# EAGLE design Rauchmelder 3.8.0 (EAGLE 9.6.2)
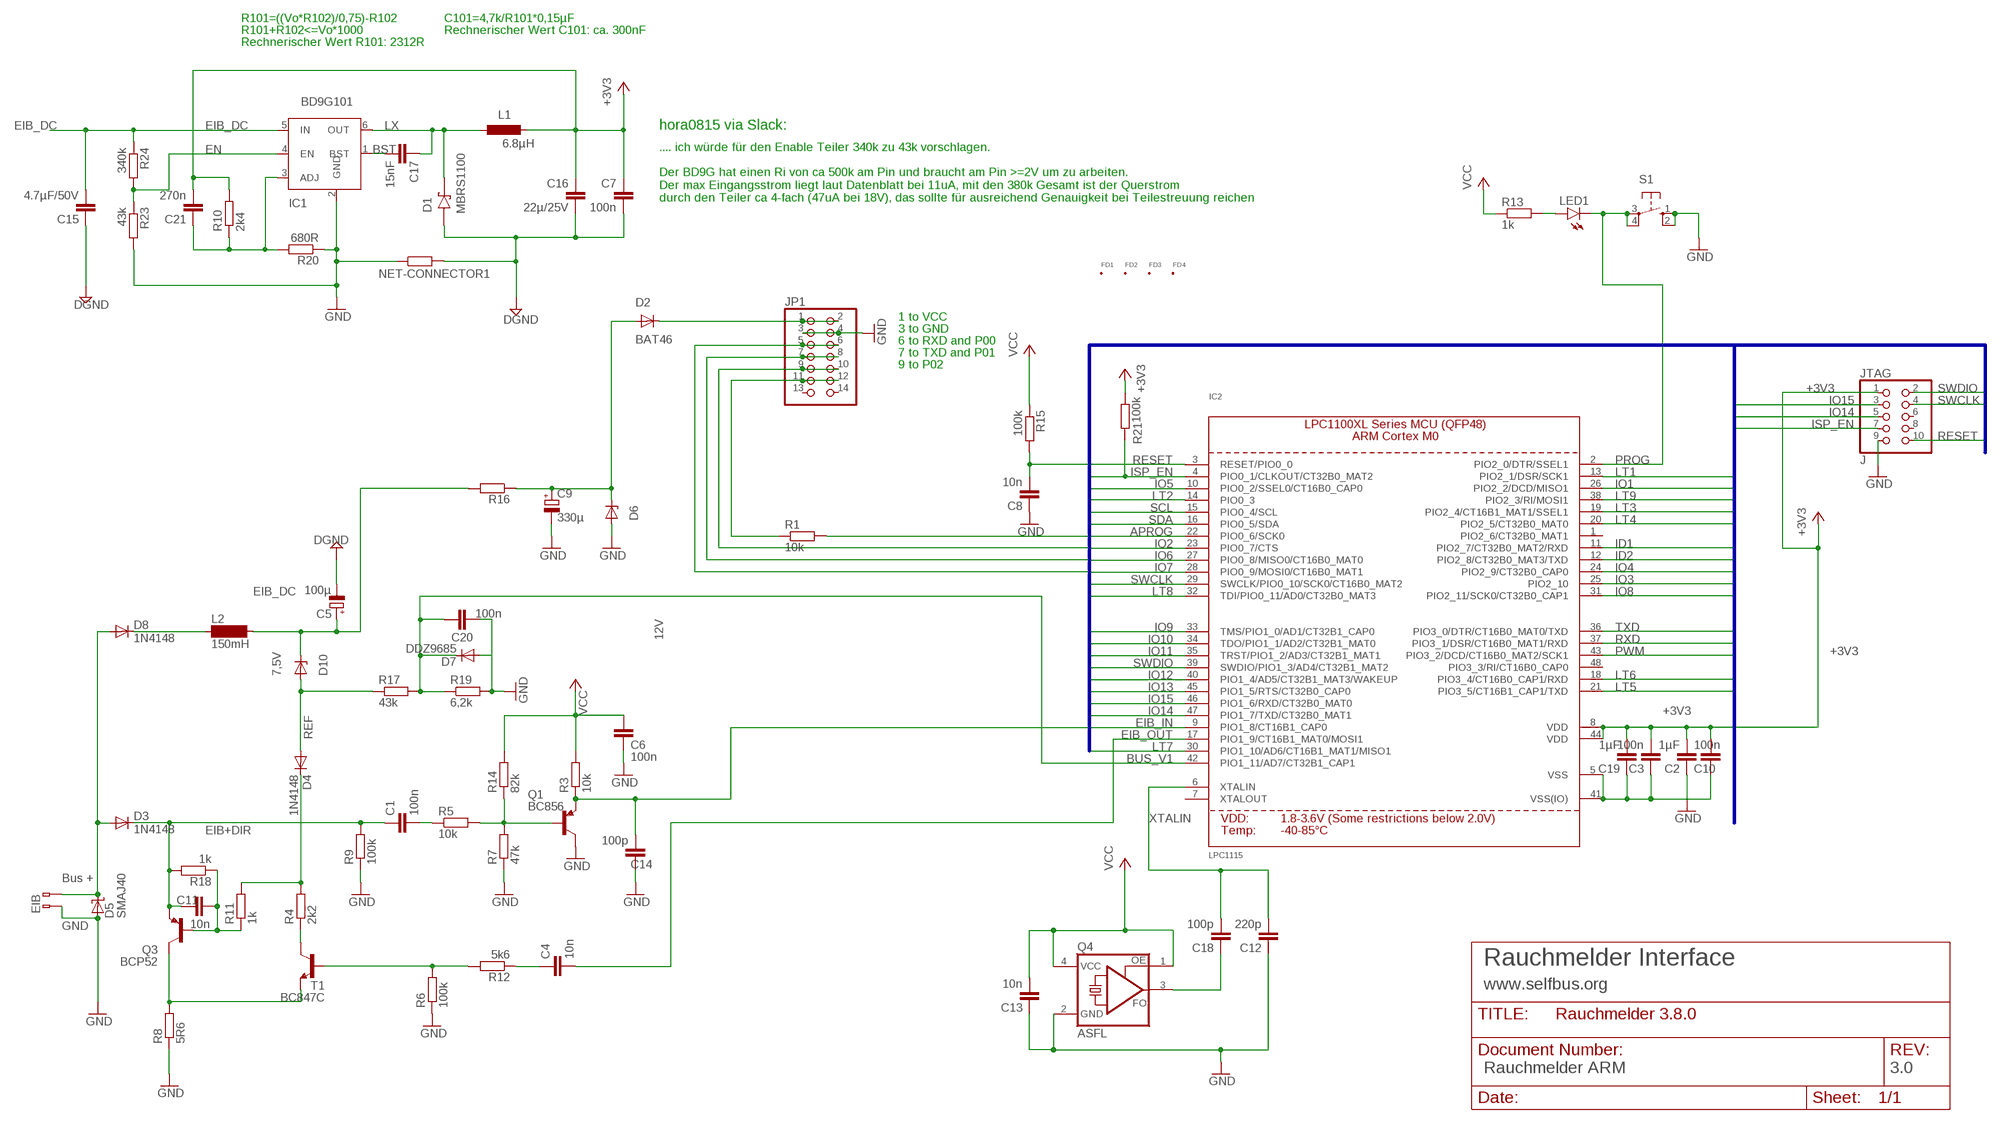
[diagram p0: schematic, sheet 1]

## Parts
C1  100n  C-EUC1206  [C1206]
C2  1µF  C-EUC1206  [C1206]
C3  100n  C-EUC1206  [C1206]
C4  10n  C-EUC1206  [C1206]
C5  100µ  CPOL-EUSANYO_SMD_C6  [SANYO-OSCON_SMD_C6]
C6  100n  C-EUC1206  [C1206]
C7  100n  C-EUC1206  [C1206]
C8  10n  C-EUC1206  [C1206]
C9  330µ  CPOL-EUE3.5-8  [E3,5-8]
C10  100n  C-EUC1206  [C1206]
C11  10n  C-EUC1206  [C1206]
C12  220p  C-EUC1206  [C1206]
C13  10n  C-EUC1206  [C1206]
C14  100p  C-EUC1206  [C1206]
C15  4.7µF/50V  C-EUC1206  [C1206]
C16  22µ/25V  C-EUC1206  [C1206]
C17  15nF  C-EUC1206  [C1206]
C18  100p  C-EUC1206  [C1206]
C19  1µF  C-EUC1206  [C1206]
C20  100n  C-EUC1206  [C1206]
C21  270n  C-EUC1206  [C1206]
D1  MBRS1100  SCHOTTKY-DIODE-MBR130LSFT1  [SOD123FL]
D2  BAT46  DIODE-MINIMELF  [MINIMELF]
D3  1N4148  DIODE-MINIMELF  [MINIMELF]
D4  1N4148  DIODE-MINIMELF  [MINIMELF]
D5  SMAJ40  SUPPRESSOR-SMBJ  [SMBJ]
D6  12V  ZPD  [MINIMELF]
D7  DDZ9685  DIODE-MINIMELF  [MINIMELF]
D8  1N4148  DIODE-MINIMELF  [MINIMELF]
D10  7,5V  ZPD  [MINIMELF]
FD1  FID_20MIL  [FID_020]
FD2  FID_20MIL  [FID_020]
FD3  FID_20MIL  [FID_020]
FD4  FID_20MIL  [FID_020]
IC1  BD9G101  BD9G101GBD9G101G-SOT23-6  [SOT23-6]
IC2  LPC1115  LPC1113/4/5_QFP48_XLSERIES  [LQFP48]
JP1  PINHD-2X7  [2X07]
JTAG  J  PINHD-2X05_2.00  [2X05M]
L1  6.8µH  L-EUL4532P  [L4532P]
L2  150mH  BS11  [BS11]
LED1  LEDCHIPLED_1206  [CHIPLED_1206]
NET-CONNECTOR1  DMX-NETCONNECTOR  [DMX-NETCONN]
Q1  BC856  BC856ALT1SMD  [SOT23-BEC]
Q3  BCP52  FZT753SMD  [SOT223]
Q4  ASFL  [ASF]
R1  10k  R-EU_R1206  [R1206]
R3  10k  R-EU_R1206  [R1206]
R4  2k2  R-EU_R1206  [R1206]
R5  10k  R-EU_R1206  [R1206]
R6  100k  R-EU_R1206  [R1206]
R7  47k  R-EU_R1206  [R1206]
R8  5R6  R-EU_R1210  [R1210]
R9  100k  R-EU_R1206  [R1206]
R10  2k4  R-EU_R1206  [R1206]
R11  1k  R-EU_R1206  [R1206]
R12  5k6  R-EU_R1206  [R1206]
R13  1k  R-EU_R1206  [R1206]
R14  82k  R-EU_R1206  [R1206]
R15  100k  R-EU_R1206  [R1206]
R16  22k  R-EU_R1206  [R1206]
R17  43k  R-EU_R1206  [R1206]
R18  1k  R-EU_R1206  [R1206]
R19  6,2k  R-EU_R1206  [R1206]
R20  680R  R-EU_R1206  [R1206]
R21  100k  R-EU_R1206  [R1206]
R23  43k  R-EU_R1206  [R1206]
R24  340k  R-EU_R1206  [R1206]
S1  10-XX  [B3F-10XX]
T1  BC847C  [SOT23]
U$1  EIB  [BUSKLEMME243-724]

## Nets
+3V3: C2.2 C3.2 C6.2 C7.1 C10.2 C13.2 C16.1 C19.2 C21.2 IC2.8(VDD) IC2.44(VDD) JTAG.1 L1.2 Q4.1(OE) Q4.4(VCC) R3.2 R10.2 R13.1 R14.2 R15.1 R21.2 ; supply symbol labelled VCC
APROG: IC2.22(PIO0_6/SCK0)
BST: C17.2 IC1.1(BST)
BUS_V1: C20.2 D7.C IC2.42(PIO1_11/AD7/CT32B1_CAP1) R17.2 R19.1
DGND: C5.- C7.2 C15.1 C16.2 D1.A NET-CONNECTOR1.P$2
EIB+: D3.A D5.C D8.A U$1.2(B-2)
EIB+DIR: C1.1 C11.1 D3.C Q3.3(E) R9.2 R18.2
EIB_DC: C5.+ C15.2 D10.C IC1.5(IN) L2.2 R16.2 R24.1
EIB_IN: C14.2 IC2.9(PIO1_8/CT16B1_CAP0) Q1.E R3.1
EIB_OUT: C4.2 IC2.17(PIO1_9/CT16B1_MAT0/MOSI1)
EN: IC1.4(EN) R23.1 R24.2
FB1: C21.1 IC1.3(ADJ) R10.1 R20.2
GND: C2.1 C3.1 C6.1 C8.1 C9.- C10.1 C12.1 C13.1 C14.1 C19.1 C20.1 D5.A D6.A D7.A IC1.2(GND) IC2.5(VSS) IC2.41(VSS(IO)) JP1.3 JP1.4 JTAG.9 NET-CONNECTOR1.P$1 Q1.C Q4.2(GND) R6.1 R7.1 R8.1 R9.1 R19.2 R20.1 R23.2 S1.1(S) S1.2(S1) U$1.1(B-1)
ID1: IC2.11(PIO2_7/CT32B0_MAT2/RXD)
ID2: IC2.12(PIO2_8/CT32B0_MAT3/TXD)
IO1: IC2.26(PIO2_2/DCD/MISO1)
IO2: IC2.23(PIO0_7/CTS)
IO3: IC2.25(PIO2_10)
IO4: IC2.24(PIO2_9/CT32B0_CAP0)
IO5: IC2.10(PIO0_2/SSEL0/CT16B0_CAP0)
IO6: IC2.27(PIO0_8/MISO0/CT16B0_MAT0)
IO7: IC2.28(PIO0_9/MOSI0/CT16B0_MAT1)
IO8: IC2.31(PIO2_11/SCK0/CT32B0_CAP1)
IO9: IC2.33(TMS/PIO1_0/AD1/CT32B1_CAP0)
IO10: IC2.34(TDO/PIO1_1/AD2/CT32B1_MAT0)
IO11: IC2.35(TRST/PIO1_2/AD3/CT32B1_MAT1)
IO12: IC2.40(PIO1_4/AD5/CT32B1_MAT3/WAKEUP)
IO13: IC2.45(PIO1_5/RTS/CT32B0_CAP0)
IO14: IC2.47(PIO1_7/TXD/CT32B0_MAT1) JTAG.5
IO15: IC2.46(PIO1_6/RXD/CT32B0_MAT0) JTAG.3
ISP_EN: IC2.4(PIO0_1/CLKOUT/CT32B0_MAT2) JTAG.7 R21.1
LT1: IC2.13(PIO2_1/DSR/SCK1)
LT2: IC2.14(PIO0_3)
LT3: IC2.19(PIO2_4/CT16B1_MAT1/SSEL1)
LT4: IC2.20(PIO2_5/CT32B0_MAT0)
LT5: IC2.21(PIO3_5/CT16B1_CAP1/TXD) JP1.9 JP1.10
LT6: IC2.18(PIO3_4/CT16B0_CAP1/RXD)
LT7: IC2.30(PIO1_10/AD6/CT16B1_MAT1/MISO1)
LT8: IC2.32(TDI/PIO0_11/AD0/CT32B0_MAT3) R1.2
LT9: IC2.38(PIO2_3/RI/MOSI1)
LX: C17.1 D1.C IC1.6(OUT) L1.1
N$1: JP1.11 JP1.12 R1.1
N$2: Q1.B R5.2 R7.2 R14.1
N$4: C11.2 Q3.1(B) R11.1 R18.1
N$9: LED1.A R13.2
N$10: C9.+ D2.A D6.C R16.1
N$13: D8.C L2.1
N$16: C1.2 R5.1
N$18: D2.C JP1.1 JP1.2
N$22: C4.1 R12.1
N$23: R4.1 T1.3(C)
N$25: D4.C R4.2 R11.2
N$26: Q3.2(C) Q3.4(C) R8.2 T1.2(E)
N$34: R6.2 R12.2 T1.1(B)
N$35: C18.1 Q4.3(FO)
PROG: IC2.2(PIO2_0/DTR/SSEL1) LED1.C S1.3(P) S1.4(P1)
PWM: IC2.43(PIO3_2/DCD/CT16B0_MAT2/SCK1)
REF: D4.A D10.A R17.1
RESET: C8.2 IC2.3(RESET/PIO0_0) JTAG.10 R15.2
RXD: IC2.37(PIO3_1/DSR/CT16B0_MAT1/RXD) JP1.5 JP1.6
SCL: IC2.15(PIO0_4/SCL)
SDA: IC2.16(PIO0_5/SDA)
SWCLK: IC2.29(SWCLK/PIO0_10/SCK0/CT16B0_MAT2) JTAG.4
SWDIO: IC2.39(SWDIO/PIO1_3/AD4/CT32B1_MAT2) JTAG.2
TXD: IC2.36(PIO3_0/DTR/CT16B0_MAT0/TXD) JP1.7 JP1.8
XTALIN: C12.2 C18.2 IC2.6(XTALIN)
Unconnected: IC2.1(PIO2_6/CT32B0_MAT1) IC2.7(XTALOUT) IC2.48(PIO3_3/RI/CT16B0_CAP0) JP1.13 JP1.14 JTAG.6 JTAG.8

## Buses
IO[1..15],LT[1..9],SCL,SDA,PWM,APROG,RXD,TXD,RESET,SWCLK,SWDIO,ISP_EN,ID1,ID2

## Notes on the sheet
- R101=((Vo*R102)/0,75)-R102 | C101=4,7k/R101*0,15µF
- R101+R102<=Vo*1000 | Rechnerischer Wert C101: ca. 300nF
- Rechnerischer Wert R101: 2312R
- hora0815 via Slack:
- .... ich würde für den Enable Teiler 340k zu 43k vorschlagen. 
  
  Der BD9G hat einen Ri von ca 500k am Pin und braucht am Pin >=2V um zu arbeiten. 
  Der max Eingangsstrom liegt laut Datenblatt bei 11uA, mit den 380k Gesamt ist der Querstrom 
  durch den Teiler ca 4-fach (47uA bei 18V), das sollte für ausreichend Genauigkeit bei Teilestreuung reichen
- 1 to VCC
- 3 to GND
- 6 to RXD and P00
- 7 to TXD and P01
- 9 to P02
- Bus +
- GND
- Rauchmelder Interface
- www.selfbus.org
- Rauchmelder ARM | 3.0

## Library data of the parts
C1-C4 C6 C8 C10-C14 C18-C20 = rcl:C-EU: CAPACITOR, European symbol
C5 C9 = rcl:CPOL-EU: POLARIZED CAPACITOR, European symbol
C7 = rcl:C-EU: CAPACITOR, European symbol; REICHELT: X7R-G0805 100N; SPICEPREFIX: C
C15 = rcl:C-EU: CAPACITOR, European symbol; REICHELT: X7R-G1206 4,7/50; SPICEPREFIX: C
C16 = rcl:C-EU: CAPACITOR, European symbol; REICHELT: X5R-G0805 22/6; SPICEPREFIX: C
C17 = rcl:C-EU: CAPACITOR, European symbol; REICHELT: X7R-G0805 15N; SPICEPREFIX: C
C21 = rcl:C-EU: CAPACITOR, European symbol; REICHELT: Y5R-G0603 220N; SPICEPREFIX: C
D1 = bt_diode:SCHOTTKY-DIODE: Schottky Diode; ALTERNATIVE#1: RB060M-60; ALTERNATIVE#2: MBRS1100; REICHELT: MBRS 1100 SMD
D2-D4 D8 = diode:DIODE-: DIODE
D5 = diode:SUPPRESSOR-: Suppressor diode
D6 D10 = diode:ZPD: Z DIODE 500 mW
D7 = diode:DIODE-: DIODE; ALTERNATIVE: MMSZ4684T1G
FD1-FD4 = Fiducial:FID: Fiducial marks. Top and Bottom copper with stop mask
IC1 = Stefan_selfbus:BD9G101G
IC2 = microbuilder:LPC1113/4/5_QFP48_XLSERIES: LPC1113/4/5 ARM Cortex M0 MCU (50MHz) - XL Series (FBD48/3x3) LPC1115FBD48/303: Max Frequency: 50MHz Flash: 64kB SRAM: 8kB ADC: 10-bit
JP1 = pinhead:PINHD-2X7: PIN HEADER
JTAG = pinhead-2:PINHD-2X05: PIN HEADER
L1 = rcl_changed:L-EU: INDUCTOR, European symbol; REICHELT: L-1616FPS 6,8µ; SPICEPREFIX: L
L2 = inductor-neosid:BS: INDUCTOR nominal inductance, magnetically screened
LED1 = led:LED: LED OSRAM: - CHIPLED LG R971, LG N971, LY N971, LG Q971, LY Q971, LO R971, LY R971 LH N974, LH R974 LS Q976, LO Q976, LY Q976 LO Q996 - Hyper CHIPLED LW Q18S LB Q993, LB Q99A, LB R99A - SideLED LS A670, LO A670, LY A670, LG A670, LP A670 LB A673, LV A673, LT A673, LW A673 LH A674 LY A675 LS A676, LA A676, LO A676, LY A676, LW A676 LS A679, LY A679, LG A679 - Hyper Micro SIDELED® LS Y876, LA Y876, LO Y876, LY Y876 LT Y87S - SmartLED LW L88C, LW L88S LB L89C, LB L89S, LG L890 LS L89K, LO L89K, LY L89K LS L896, LA L896, LO L896, LY L896 - TOPLED LS T670, LO T670, LY T670, LG T670, LP T670 LSG T670, LSP T670, LSY T670, LOP T670, LYG T670 LG T671, LOG T671, LSG T671 LB T673, LV T673, LT T673, LW T673 LH T674 LS T676, LA T676, LO T676, LY T676, LB T676, LH T676, LSB T676, LW T676 LB T67C, LV T67C, LT T67C, LS T67K, LO T67K, LY T67K, LW E67C LS E67B, LA E67B, LO E67B, LY E67B, LB E67C, LV E67C, LT E67C LW T67C LS T679, LY T679, LG T679 LS T770, LO T770, LY T770, LG T770, LP T770 LB T773, LV T773, LT T773, LW T773 LH T774 LS E675, LA E675, LY E675, LS T675 LS T776, LA T776, LO T776, LY T776, LB T776 LHGB T686 LT T68C, LB T68C - Hyper Mini TOPLED® LB M676 - Mini TOPLED Santana® LG M470 LS M47K, LO M47K, LY M47K Source: http://www.osram.convergy.de LUXEON: - LUMILED® LXK2-PW12-R00, LXK2-PW12-S00, LXK2-PW14-U00, LXK2-PW14-V00 LXK2-PM12-R00, LXK2-PM12-S00, LXK2-PM14-U00 LXK2-PE12-Q00, LXK2-PE12-R00, LXK2-PE12-S00, LXK2-PE14-T00, LXK2-PE14-U00 LXK2-PB12-K00, LXK2-PB12-L00, LXK2-PB12-M00, LXK2-PB14-N00, LXK2-PB14-P00, LXK2-PB14-Q00 LXK2-PR12-L00, LXK2-PR12-M00, LXK2-PR14-Q00, LXK2-PR14-R00 LXK2-PD12-Q00, LXK2-PD12-R00, LXK2-PD12-S00 LXK2-PH12-R00, LXK2-PH12-S00 LXK2-PL12-P00, LXK2-PL12-Q00, LXK2-PL12-R00 Source: www.luxeon.com KINGBRIGHT: KA-3528ASYC Source: www.kingbright.com
NET-CONNECTOR1 = dmx_Elko_Test:DMX-NETCONNECTOR: Verbindung zweier unterschiedlicher Netze
Q1 = transistor-pnp:BC856*: PNP Transistror
Q3 = transistor-pnp:FZT753SMD: PNP Transistor
Q4 = crystal:ASF*: CRYSTAL CLOCK OSCILLATORS 5.0 Vdc or 3.3 Vdc - LOW PROFILE ULTRA MINIATURE CERAMIC SURFACE MOUNT Source: http://www.abracon.com/Oscillators/asf1-L-L1.pdf; MPN: ASFLM1-50.000MHZ-C-T; OC_FARNELL: 1838931; OC_NEWARK: 99M0411
R1 R3-R7 R9 R11-R19 R21 = rcl:R-EU_: RESISTOR, European symbol
R8 R23 R24 = rcl:R-EU_: RESISTOR, European symbol; SPICEPREFIX: R
R10 = rcl:R-EU_: RESISTOR, European symbol; REICHELT: SMD 1/4W 2,4K; SPICEPREFIX: R
R20 = rcl:R-EU_: RESISTOR, European symbol; REICHELT: SMD-0805 680; SPICEPREFIX: R
S1 = switch-omron:10-XX: OMRON SWITCH
T1 = transistor:BC847C: NPN TRANSISTOR
U$1 = con-wago:EIB

## Board
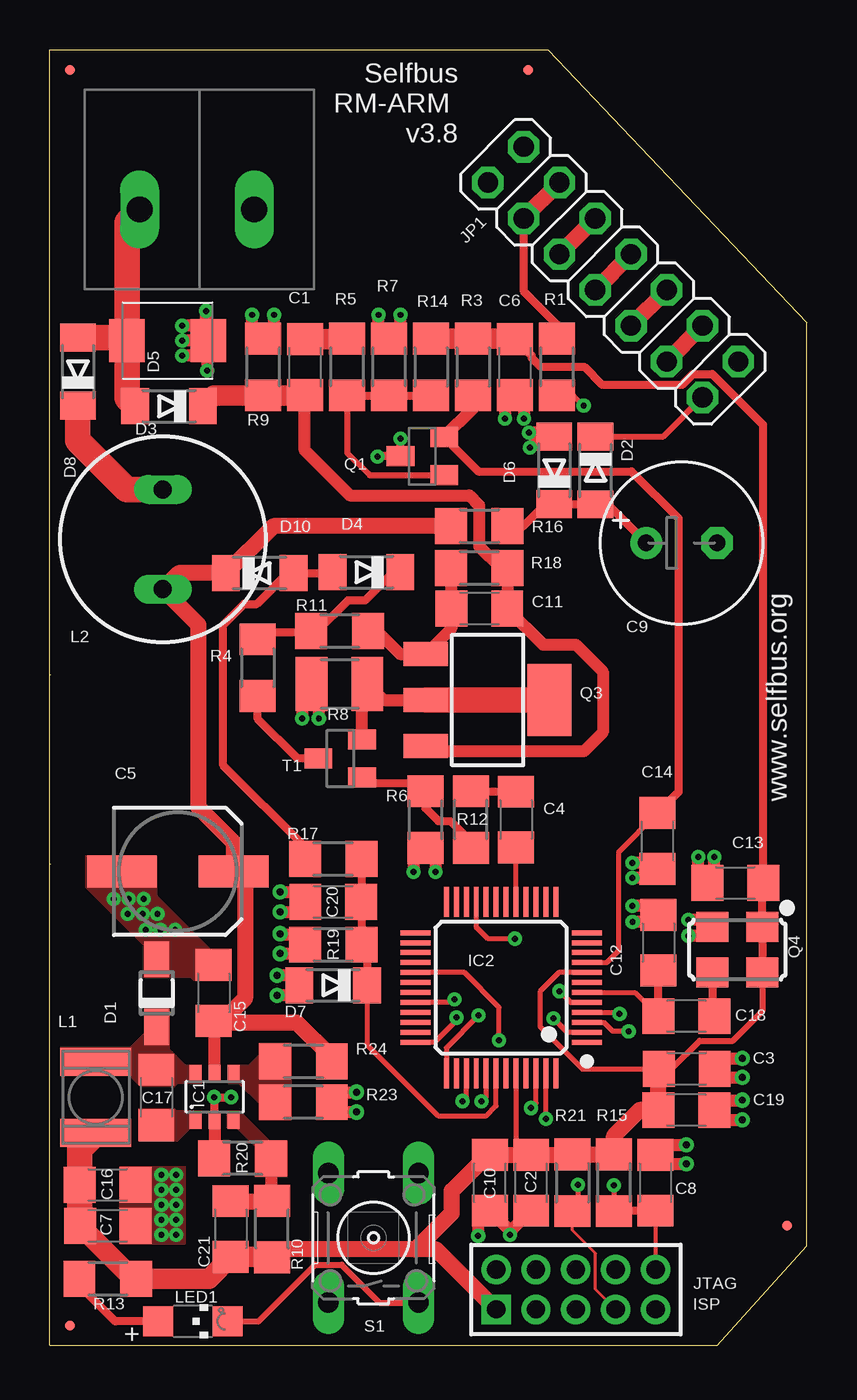
[diagram p1: board, top side]
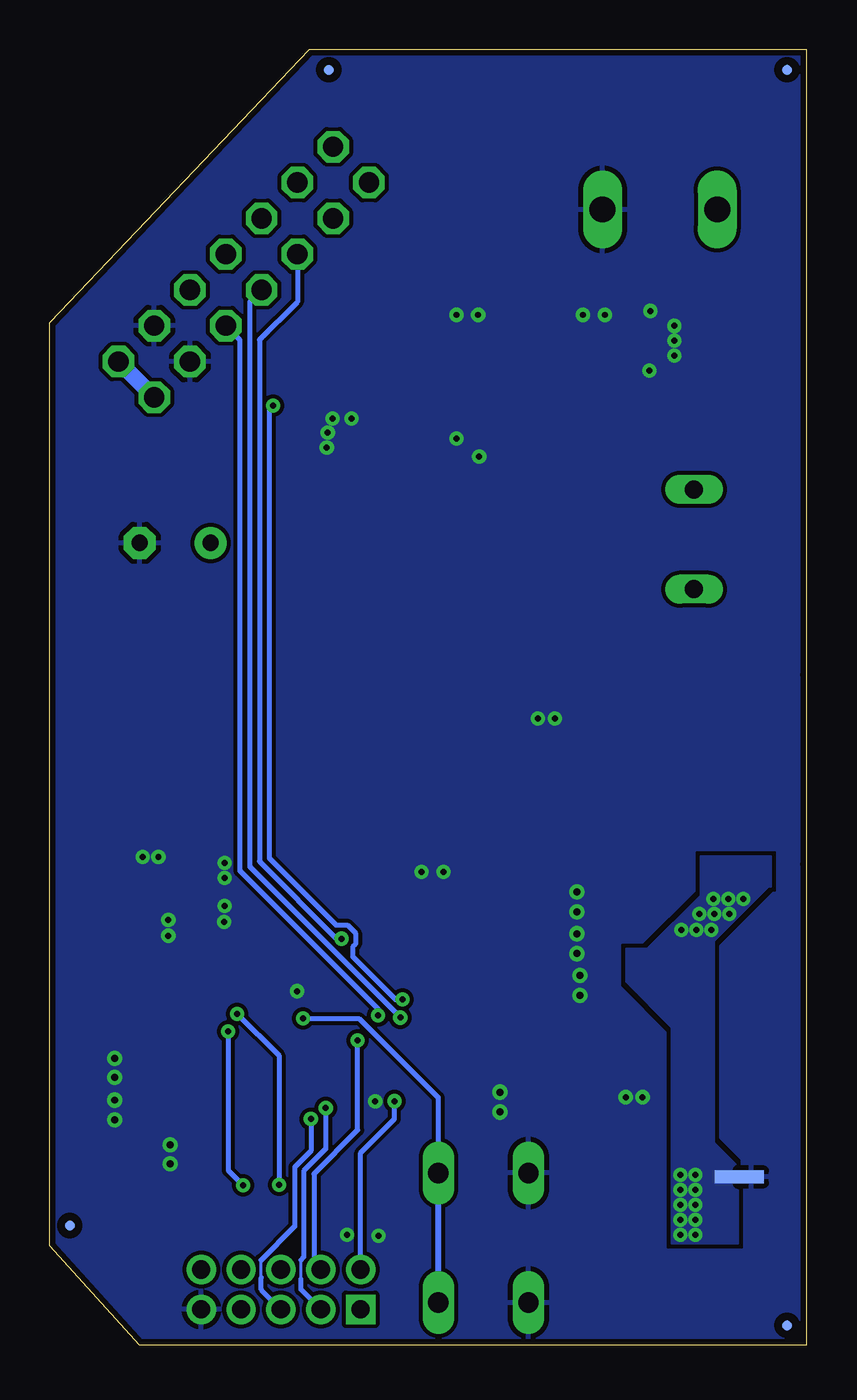
[diagram p2: board, bottom side, seen from below]

Size 38 x 65 mm. Coordinates in mm from the lower left corner, seen from the top.
Outline: 0,33.66 0.04,33.66
Outline: 0.04,24.13 0,24.13
Outline: 0,0 0,65 25,65 38,51.3 38,5 33.5,0 0,0
Copper layers (1*16): Top 0.035mm / dielectric 1.5mm / Bottom 0.035mm
Design rules "default *": minimum track width 6mil, minimum drill 0.3mm, track to track 8mil, track to pad 7mil, pad to pad 8mil, via to via 8mil, smd to smd 0mil, copper to edge 12mil, drill to drill 8mil, minimum pad ring 11mil, minimum via ring 8mil, stop-mask expansion 4mil, vias tented up to drill 12mil, thermal gap 10mil
tRestrict: area 32.5,18.4 to 36.9,23.1

### Footprints (pad centres in the part's own frame; a part is rotated, then mirrored left to right if it is on the bottom)
C1206 = smd 1.6 x 1.8: 1 -1.4,0; 2 1.4,0
SANYO-OSCON_SMD_C6 = smd 3.5 x 1.6: + 2.8,0; - -2.8,0
E3,5-8 = drill 0.813 pad 1.6: + -1.778,0 | drill 0.813 pad 1.6 octagon: - 1.778,0
SOD123FL = smd 1.8 x 1.25: A 1.7,0; C -1.7,0
MINIMELF = smd 1.4 x 1.8: A 1.7,0; C -1.7,0
SMBJ = smd 1.78 x 2.16: A 2.04,0; C -2.03,0
FID_020 = smd 0.508 x 0.508 bottom: FIDB 0,0 | smd 0.508 x 0.508: FIDT 0,0
SOT23-6 = smd 0.6 x 0.9: 1 -0.95,-1.15; 2 0,-1.15; 3 0.95,-1.15; 4 0.95,1.15; 5 0,1.15; 6 -0.95,1.15
LQFP48 = smd 1.5 x 0.25: 1 -4.3,2.75; 2 -4.3,2.25; 3 -4.3,1.75; 4 -4.3,1.25; 5 -4.3,0.75; 6 -4.3,0.25; 7 -4.3,-0.25; 8 -4.3,-0.75; 9 -4.3,-1.25; 10 -4.3,-1.75; 11 -4.3,-2.25; 12 -4.3,-2.75; 25 4.3,-2.75; 26 4.3,-2.25; 27 4.3,-1.75; 28 4.3,-1.25; 29 4.3,-0.75; 30 4.3,-0.25; 31 4.3,0.25; 32 4.3,0.75; 33 4.3,1.25; 34 4.3,1.75; 35 4.3,2.25; 36 4.3,2.75 | smd 0.25 x 1.5: 13 -2.75,-4.3; 14 -2.25,-4.3; 15 -1.75,-4.3; 16 -1.25,-4.3; 17 -0.75,-4.3; 18 -0.25,-4.3; 19 0.25,-4.3; 20 0.75,-4.3; 21 1.25,-4.3; 22 1.75,-4.3; 23 2.25,-4.3; 24 2.75,-4.3; 37 2.75,4.3; 38 2.25,4.3; 39 1.75,4.3; 40 1.25,4.3; 41 0.75,4.3; 42 0.25,4.3; 43 -0.25,4.3; 44 -0.75,4.3; 45 -1.25,4.3; 46 -1.75,4.3; 47 -2.25,4.3; 48 -2.75,4.3
2X07 = drill 1.016 octagon: 1 -7.62,-1.27; 2 -7.62,1.27; 3 -5.08,-1.27; 4 -5.08,1.27; 5 -2.54,-1.27; 6 -2.54,1.27; 7 0,-1.27; 8 0,1.27; 9 2.54,-1.27; 10 2.54,1.27; 11 5.08,-1.27; 12 5.08,1.27; 13 7.62,-1.27; 14 7.62,1.27
2X05M = drill 0.914 square: 1 -4,-1 | drill 0.914: 2 -4,1; 3 -2,-1; 4 -2,1; 5 0,-1; 6 0,1; 7 2,-1; 8 2,1; 9 4,-1; 10 4,1
L4532P = smd 1.397 x 3.556: 1 -1.778,0; 2 1.778,0
BS11 = drill 0.9 long: 1 -2.5,0; 2 2.5,0
CHIPLED_1206 = smd 1.5 x 1.5: A 0,-1.75; C 0,1.75
DMX-NETCONN = smd 1.27 x 0.635: P$1 -0.6,0; P$2 0.6,0
SOT23-BEC = smd 1 x 1.4: B -0.95,-1.1; C 0,1.1; E 0.95,-1.1
SOT223 = smd 1.219 x 2.235: 1 -2.311,-3.099; 2 0,-3.099; 3 2.311,-3.099 | smd 3.6 x 2.2: 4 0,3.099
ASF = smd 1.6 x 1.5: 1 -1.25,-1.15; 2 1.25,-1.15; 3 1.25,1.15; 4 -1.25,1.15
R1206 = smd 1.6 x 1.803: 1 -1.422,0; 2 1.422,0
R1210 = smd 1.6 x 2.7: 1 -1.4,0; 2 1.4,0
B3F-10XX = drill 1.016 long: 1 -3.251,2.261; 2 3.251,2.261; 3 -3.251,-2.261; 4 3.251,-2.261
SOT23 = smd 1 x 1.4: 1 -0.95,-1.1; 2 0.95,-1.1; 3 0,1.1
BUSKLEMME243-724 = drill 1.3 long: 1 -2.875,0; 2 2.875,0

### Placement (x,y rotation side)
C1  12.81,49.08 90 top
C2  24.16,8.16 90 top
C3  31.96,13.86 180 top
C4  23.4,26.38 270 top
C5  6.42,23.78 0 top
C6  23.35,49.08 90 top
C7  2.92,6 0 top
C8  30.39,8.16 270 top
C9  31.71,40.26 0 top
C10  22.08,8.16 90 top
C11  21.55,36.96 180 top
C12  30.55,20.2 270 top
C13  34.4,23.2 0 top
C14  30.5,25.3 90 top
C15  8.23,17.68 270 top
C16  2.9,8.05 0 top
C17  5.35,12.43 270 top
C18  31.95,16.51 180 top
C19  31.95,11.8 180 top
C20  14.22,22.25 0 top
C21  9.08,5.83 270 top
D1  5.36,17.68 90 top
D2  27.39,43.9 270 top
D3  5.98,47.12 180 top
D4  15.89,38.79 180 top
D5  5.91,50.4 0 top
D6  25.32,43.9 90 top
D7  14.22,18.06 180 top
D8  1.41,48.86 90 top
D10  10.53,38.74 0 top
FD1  1,64 0 top
FD2  37,6 0 top
FD3  24,64 0 top
FD4  1,1 0 top
IC1  8.27,12.47 0 top
IC2  22.65,17.95 180 top
JP1  28.27,53.85 135 top
JTAG  26.4,2.8 0 top
L1  2.3,12.44 270 top
L2  5.67,40.44 270 top
LED1  7.18,1.2 270 top
NET-CONNECTOR1  3.4,8.45 180 bottom
Q1  18.69,44.61 90 top
Q3  21.97,32.38 270 top
Q4  34.5,19.85 180 top
R1  25.46,49.08 270 top
R3  21.25,49.08 90 top
R4  10.43,34 90 top
R5  14.92,49.08 270 top
R6  18.85,26.38 90 top
R7  17.03,49.08 270 top
R8  14.53,33.19 0 top
R9  10.71,49.08 270 top
R10  11.15,5.83 270 top
R11  14.54,35.84 180 top
R12  21.13,26.38 270 top
R13  2.91,3.34 180 top
R14  19.14,49.08 90 top
R15  28.32,8.16 270 top
R16  21.55,41.1 180 top
R17  14.22,24.39 0 top
R18  21.55,38.99 0 top
R19  14.22,20.1 180 top
R20  9.68,9.38 0 top
R21  26.24,8.16 90 top
R23  12.73,12.2 0 top
R24  12.73,14.25 180 top
S1  16.24,5.39 90 top
T1  14.58,29.44 90 top
U$1  7.38,56.99 180 top

### Tracks (layer width: path | path; a pad name or v marks a point on that pad's centre or on a via)
+3V3
  Top 0.254: IC2.8 25.55,18.7 24.6,17.75 24.6,15.99 26.73,13.86 C3.2 | IC2.44 23.4,10.32 C2.2
  Top 0.305: C3.2 31.19,13.86 32.61,15.28 34.29,15.28 35.75,16.75 35.75,18.15
  Top 0.406: C3.2 | 35.8,21.05 Q4.1 | C6.2 24.18,49.66 24.18,49.55 24.63,49.09 26.82,49.09 27.72,48.19 31.74,48.19 32.28,48.73 33.24,48.73 35.8,46.18 C13.2 35.75,23.15 Q4.1 | Q4.1 Q4.4 35.75,18.15
  Top 0.813: R10.2 11.55,4.81 18.35,4.81 | 18.35,4.81 20.18,6.64 20.18,7.75 21.98,9.56 C10.2 C2.2 26.22,9.56 R21.2 R15.1 28.32,10.51 29.61,11.8 C19.2 C3.2 | JTAG.1 19.39,4.81 18.35,4.81
  Top 1.016: C7.1 4.17,3.34 R13.1 7.99,3.34 C21.2 11.13,4.43 R10.2 | R14.2 R3.2 23.33,50.51 C6.2
  Top 1.27: L1.2 1.5,9.86 C16.1 1.5,6.02 C7.1
BST
  pour Top (no thermals): 4.45,11.85 6.25,11.85 6.35,11.75 7.05,11.75 7.6,11.75 7.6,10.9 7.05,10.9 6.4,10.25 6.2,10.25 4.45,10.25
BUS_V1
  Top 0.254: D7.C 15.92,15.08 19.48,11.52 21.92,11.52 22.4,12 IC2.42
  Top 0.406: R17.2 15.65,22.27 C20.2 15.65,22.23 R19.1 15.92,19.82 D7.C
DGND  (via drill 0.3)
  Top 0.61: C5.- 3.95,23.45
  other vias: 3.2,22.4 3.95,22.4 4.7,22.4 3.9,21.65 4.65,21.65 5.4,21.65 4.8,20.85 5.55,20.85 6.3,20.85 5.6,8.55 6.35,8.55 6.35,7.8 5.6,7.8 5.6,7.05 6.35,7.05 6.35,6.3 5.6,6.3 5.6,5.55 6.35,5.55
  pour Top (no thermals): 1.8,24.55 1.8,23 4.7,20.1 4.7,18.45 7.1,18.45 7.25,18.3 9.05,18.3 9.05,19.85 8.05,19.85 5.35,22.55 5.35,24.55
  pour Top (no thermals): 3.5,8.95 3.5,5.1 6.8,5.1 6.8,8.95
  pour Bottom (isolate 0.305, no thermals): 3.45,5.1 6.8,5.1 6.8,8.95 6.8,15.95 9.1,18.25 9.1,19.9 8,19.9 5.35,22.55 5.35,22.6 5.35,24.55 1.8,24.55 1.8,23 1.95,23 2,22.95 4.65,20.3 4.65,10.15 3.45,8.95
EIB+
  Top 1.27: U$1.2 3.88,56.36 D5.C | D5.C 3.72,50.56 D8.A | D3.A 3.88,47.52 D5.C
EIB+DIR
  Top 0.406: 12.79,47.66 C1.1
  Top 0.61: 12.79,47.66 12.79,44.91 15.06,42.64 21.05,42.64 21.55,42.14 21.55,40.1 22.66,38.99 R18.2 22.98,36.98 C11.1 24.77,35.15 26.4,35.15 27.75,33.8 27.75,30.75 26.8,29.8 19.14,29.8 Q3.3
  Top 1.016: D3.C 8.22,47.66 R9.2 12.79,47.66
EIB_DC
  Top 0.61: IC1.5 8.27,16.24 C15.2
  Top 0.813: R16.2 11.22,41.1 8.86,38.74 D10.C 6.47,38.74 L2.2 7.45,36.16 7.45,27 9.22,25.23 C5.+ 9.8,23.2 9.8,17.39 8.68,16.27 C15.2 8.32,16.19 12.4,16.19 14.16,14.43 R24.1
EIB_IN
  Top 0.254: IC2.9 27.95,19.2 28.55,19.8 28.55,24.75 C14.2
  Top 0.406: Q1.E 21.5,43.85 29.2,43.85 31.55,41.5 31.55,27.75 C14.2
  Top 0.61: R3.1 21.25,47.01 Q1.E
EIB_OUT
  Top 0.254: IC2.17 C4.2
EN
  pour Top (no thermals): 8.95,13.15 9.5,13.15 10.5,12.15 10.5,11.3 12.1,11.3 12.1,15.15 10.5,15.15 10.5,14.55 10,14.05 8.95,14.05
FB1
  Top 0.61: R20.2 11.1,7.26 11.13,7.23
  Top 0.813: C21.1 11.13,7.23 R10.1
  pour Top (no thermals): 8.9,11.75 8.9,10.9 9.4,10.9 10.3,10 10.3,8.45 11.9,8.45 11.9,10.25 11,10.25 9.5,11.75
GND  (via drill 0.3, 0.35)
  Top 0.254: v25.58,17.77 25.9,17.45 26.14,17.2 IC2.5 | IC2.41 21.9,12.48 v21.67,12.24
  Top 0.406: IC1.2 8.27,12.43 v8.25,12.45 v9.1,12.45 | v17.6,45.5 v17.59,45.49 Q1.C v16.46,44.61 v16.45,44.6 | C6.1 22.85,47.18 | C20.1 12.4,22.25
  Top 0.61: IC1.2 8.27,9.39 R20.1 | 22.85,47.18 v22.85,46.5 | v11.55,22.75 12.32,22.75 C20.1 12.33,21.75 v11.55,21.75 | v11.55,20.65 11.6,20.6 12.3,20.6 R19.2 12.35,19.65 v11.55,19.65 | v11.4,18.55 12.04,18.55 D7.A 12.01,17.55 v11.4,17.55 | v15.4,12.7 14.66,12.7 R23.2 14.66,11.7 v15.4,11.7 | v34.75,14.4 33.9,14.4 C3.1 33.78,13.45 v34.75,13.45 | v34.75,12.3 33.85,12.3 C19.1 33.85,11.3 v34.75,11.3 | v31.95,10.05 30.89,10.05 C8.1 30.85,9.1 v31.95,9.1 | v21.5,5.5 21.5,6.17 C10.1 23.08,5.76 | 23.08,5.76 v23.08,5.55 | C2.1 23.16,5.76 23.08,5.76 | C6.1 23.8,47.24 v23.8,46.5 | v29.23,24.2 30.2,24.2 C14.1 30.05,23.45 v29.23,23.45 | v29.23,22.05 30.1,22.05 C12.1 30.2,21.25 v29.25,21.25 | v32.55,24.5 32.55,23.65 C13.1 33.35,23.55 v33.35,24.5 | v32.05,21.35 32.9,21.35 Q4.2 32.8,20.55 v32.05,20.55 | D5.A 7.2,51.15 v6.65,51.15 | D5.A v6.65,50.4 | D5.A 7.95,50.05 7.55,49.65 v6.65,49.65 | D5.A 7.85,50.5 v7.85,51.9 | D5.A 7.9,50.36 v7.9,48.9 | v12.65,31.45 12.65,32.73 R8.1 13.5,32.8 v13.5,31.45 | v18.25,23.75 18.25,24.35 R6.1 19.35,24.45 v19.35,23.75 | v17.6,51.7 17.6,51.08 R7.1 16.5,51.03 v16.5,51.7 | v11.25,51.7 11.25,51.05 R9.1 10.15,51.06 v10.15,51.7 | v24.05,45.8 25.12,45.8 D6.A 25.22,45.6 24.82,45.2 24.25,45.2 v24.1,45.05
  Top 0.813: JP1.4 JP1.3
  pour Bottom (rank 2): 33.5,0 0,0 0,65 25,65 38,51.3 38,5
IO14  (via drill 0.3)
  Top 0.254: v24.9,11.35 IC2.47
  Bottom 0.152: 27.39,3.39 27.39,4.26 27.4,4.27
  Bottom 0.254: v24.9,11.35 24.9,9.74 25.71,8.93 25.71,5.96 27.4,4.27 | 27.39,3.39 27.39,2.79 JTAG.5
IO15  (via drill 0.3)
  Top 0.254: v24.15,11.9 24.4,12.15 IC2.46
  Bottom 0.152: 25.4,3.33 25.4,4.27
  Bottom 0.254: v24.15,11.9 24.15,9.85 25.25,8.74 25.25,4.42 25.4,4.27 | JTAG.3 25.4,2.8 25.4,3.33
ISP_EN  (via drill 0.3)
  Top 0.152: JTAG.7 27.39,2.81 27.39,4.61 26.24,5.76 R21.1
  Top 0.254: IC2.4 28.53,16.7 v28.6,16.63 | v26.5,8.05 26.5,7 R21.1
  Bottom 0.254: v28.6,16.63 26.5,14.54 v26.5,8.05
LT5  (via drill 0.3)
  Top 0.254: v23.35,20.4 22,20.4 21.4,21 IC2.21
  Top 0.813: JP1.9 JP1.10
  Bottom 0.254: JP1.10 25.58,52.35 27.48,50.45 27.48,24.28 23.6,20.4 v23.35,20.4
LT8  (via drill 0.3)
  Top 0.254: R1.2 26.28,47.66 v26.79,47.15 | v20.3,17.35 20.15,17.2 IC2.32
  Bottom 0.254: v26.79,47.15 26.99,46.95 26.99,24.44 23.64,21.08 23.07,21.08 22.67,20.68 22.67,20.12 22.8,19.98 22.8,19.5 20.65,17.35 v20.3,17.35
LX
  pour Top (no thermals): 6,16.85 4.8,16.85 4.75,16.8 4.75,15.65 4.05,14.95 0.55,14.95 0.55,13.55 4,13.55 4.55,13 6.25,13 6.4,13.15 7.6,13.15 7.6,14.05 6.8,14.05 6,14.85
N$1
  Top 0.406: R1.1 25.46,51.21 23.78,52.89 JP1.12
  Top 0.813: JP1.11 JP1.12
N$2
  Top 0.305: R5.2 14.92,44.78 16.05,43.65 Q1.B
  Top 0.406: R5.2 R7.2 R14.1
N$4
  Top 0.61: R18.1 20.13,36.98 C11.2 20.15,35.97 Q3.1 17.57,34.69 16.42,35.84 R11.1
N$9
  Top 0.406: LED1.A 3.28,1.2 1.49,2.99 R13.2
N$10
  Top 0.406: R16.1 23.76,41.1 24.87,42.2 D6.C D2.A 28,42.2 C9.+
N$13
  Top 1.27: D8.C 1.41,45.39 3.86,42.94 L2.1
N$16
  Top 0.406: 14.9,50.48 R5.1
  Top 1.016: C1.2 14.9,50.48
N$18
  Top 0.305: D2.C 30.79,45.59 JP1.2
  Bottom 0.813: JP1.2 JP1.1
N$22
  Top 0.406: R12.1 21.15,27.77 C4.1
N$23
  Top 0.406: T1.3 12.43,29.44 10.43,31.43 R4.1
N$25
  Top 0.406: R4.2 10.78,35.77 13.06,35.77 R11.2 13.43,35.84 14.96,37.37 15.83,37.37 17.24,38.79 D4.C
N$26
  Top 0.406: T1.2 15.96,30.67 | R8.2 16.51,32.64 | 18.62,32.64 Q3.2
  Top 0.61: T1.2 15.68,32.93 R8.2 16.74,32.38 Q3.2
  Top 1.27: Q3.2 Q3.4
N$34
  Top 0.406: T1.1 15.98,28.19 18.44,28.19 R6.2 18.85,26.95 19.5,26.3 20.1,26.3 21.13,25.27 R12.2
N$35
  Top 0.406: Q4.3 33.25,16.61 C18.1
PROG  (via drill 0.3)
  Top 0.254: IC2.2 25.98,15.7 v25.28,16.4
  Top 0.305: LED1.C 10.47,1.2 13.32,4.04 14.65,4.04 16.55,2.14 S1.3
  Bottom 0.254: v25.28,16.4 22.48,16.4 18.5,12.42 S1.4
  Bottom 0.305: S1.3 S1.4
REF
  Top 0.406: D4.A 14.14,38.74 D10.A 11.93,38.74 10.4,37.2 9.75,37.2 8.7,36.15 8.7,29.1 12.8,25 R17.1
RESET  (via drill 0.3)
  Top 0.2: C8.2 JTAG.10
  Top 0.254: IC2.3 27.8,16.2 28.25,15.75 v29.05,15.75 | v28.3,8.02 28.3,6.75 R15.2
  Top 0.406: C8.2 30.37,6.74 R15.2
  Bottom 0.254: v29.05,15.75 29.05,8.77 v28.3,8.02
RXD  (via drill 0.3)
  Top 0.254: v21.52,16.55 19.9,14.93 IC2.37
  Top 0.813: JP1.5 JP1.6
  Bottom 0.254: JP1.6 28.47,50.46 28.47,23.82 21.52,16.87 v21.52,16.55
SWCLK  (via drill 0.3)
  Top 0.254: v22.55,15.3 22.55,16.95 20.8,18.7 IC2.29
  Bottom 0.254: JTAG.4 24.75,4.15 24.75,8.6 22.55,10.8 v22.55,15.3
SWDIO  (via drill 0.3)
  Top 0.254: v20.7,12.25 20.9,12.45 IC2.39
  Bottom 0.254: JTAG.2 22.4,9.65 20.7,11.35 v20.7,12.25
TXD  (via drill 0.3)
  Top 0.254: v20.41,16.44 20.41,16.3 19.31,15.2 IC2.36
  Top 0.813: JP1.7 JP1.8
  Bottom 0.254: JP1.8 27.97,52.35 27.97,24.02 20.41,16.46 v20.41,16.44
XTALIN
  Top 0.254: IC2.6 29.36,17.7 C18.2
  Top 0.406: C18.2 C12.2

### Text on the board
tPlace: Selfbus / RM-ARM / v3.8 | +
tNames: www.selfbus.org | ISP